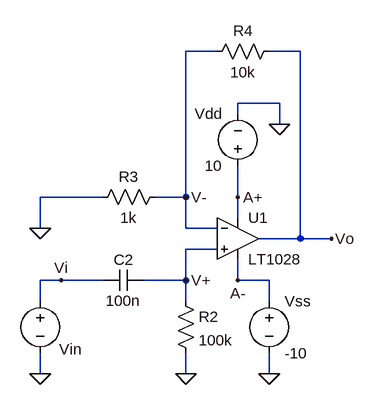
[diagram p0: schematic 1d2.asc]
1d2.asc, the LTspice schematic file:
Version 4
SHEET 1 880 680
WIRE 512 -384 464 -384
WIRE 640 -384 592 -384
WIRE 608 -304 544 -304
WIRE 544 -288 544 -304
WIRE 608 -272 608 -304
WIRE 336 -160 240 -160
WIRE 464 -160 464 -384
WIRE 464 -160 416 -160
WIRE 544 -160 544 -208
WIRE 544 -128 544 -160
WIRE 240 -112 240 -160
WIRE 464 -112 464 -160
WIRE 512 -112 464 -112
WIRE 640 -96 640 -384
WIRE 640 -96 576 -96
WIRE 688 -96 640 -96
WIRE 512 -80 464 -80
WIRE 272 -32 240 -32
WIRE 336 -32 272 -32
WIRE 464 -32 464 -80
WIRE 464 -32 400 -32
WIRE 544 -32 544 -64
WIRE 592 -32 544 -32
WIRE 240 0 240 -32
WIRE 464 0 464 -32
WIRE 592 0 592 -32
WIRE 240 112 240 80
WIRE 464 112 464 80
WIRE 592 112 592 80
FLAG 240 112 0
FLAG 464 112 0
FLAG 688 -96 Vo
FLAG 272 -32 Vi
FLAG 240 -112 0
FLAG 464 -32 V+
FLAG 464 -160 V-
FLAG 592 112 0
FLAG 608 -272 0
FLAG 544 -32 A-
FLAG 544 -160 A+
SYMBOL voltage 240 -16 R0
WINDOW 3 5 94 Invisible 0
WINDOW 0 29 90 Left 2
SYMATTR Value DC 0 AC 1 sin(0 10mV 10kHz 0 0 0)
SYMATTR InstName Vin
SYMBOL cap 400 -48 R90
WINDOW 0 0 32 VBottom 2
WINDOW 3 32 32 VTop 2
SYMATTR InstName C2
SYMATTR Value 100n
SYMBOL res 448 -16 R0
SYMATTR InstName R2
SYMATTR Value 100k
SYMBOL res 432 -176 R90
WINDOW 0 0 56 VBottom 2
WINDOW 3 32 56 VTop 2
SYMATTR InstName R3
SYMATTR Value 1k
SYMBOL res 608 -400 R90
WINDOW 0 0 56 VBottom 2
WINDOW 3 32 56 VTop 2
SYMATTR InstName R4
SYMATTR Value 10k
SYMBOL Opamps\\LT1028 544 -160 R0
SYMATTR InstName U1
SYMBOL voltage 544 -192 R180
WINDOW 0 24 96 Left 2
WINDOW 3 24 16 Left 2
SYMATTR InstName Vdd
SYMATTR Value 10
SYMBOL voltage 592 -16 R0
SYMATTR InstName Vss
SYMATTR Value -10

The netlist it stands for:
* 1d2.asc
Vin Vi 0 DC 0 AC 1 sin(0 10mV 10kHz 0 0 0)
C2 V+ Vi 100n
R2 V+ 0 100k
R3 V- 0 1k
R4 Vo V- 10k
XU1 V+ V- A+ A- Vo LT1028  ; pins In+ In- V+ V- OUT
Vdd A+ 0 10
Vss A- 0 -10
.lib LTC.lib
.backanno
.end